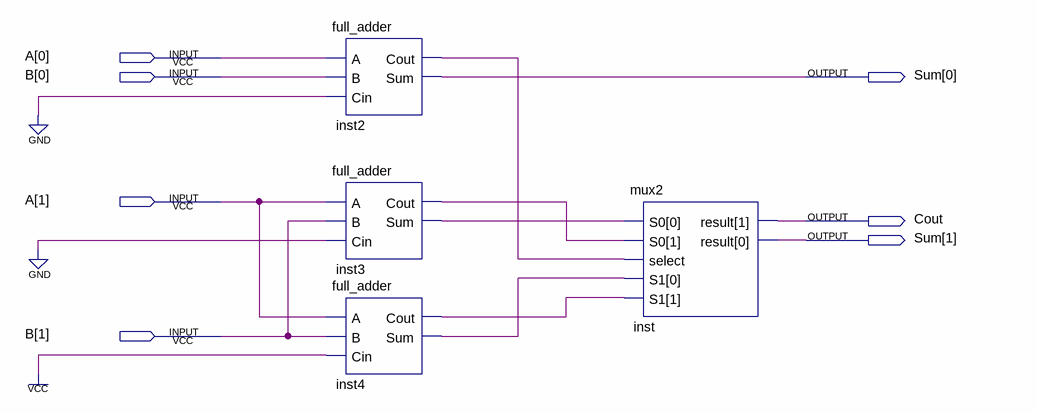
[diagram p0: schematic sheet]
// Quartus schematic csa2.bdf as structural Verilog: 4 symbols, 7 pins
module csa2 (
  input  [1:0] A,
  input  [1:0] B,
  output [1:0] Sum,
  output Cout
);

  wire inst2_cout, inst3_cout, inst3_sum, inst4_cout, inst4_sum;

  full_adder inst2 (.A(A[0]), .B(B[0]), .Cin(1'b0), .Cout(inst2_cout), .Sum(Sum[0]));
  full_adder inst3 (.A(A[1]), .B(B[1]), .Cin(1'b0), .Cout(inst3_cout), .Sum(inst3_sum));
  full_adder inst4 (.A(A[1]), .B(B[1]), .Cin(1'b1), .Cout(inst4_cout), .Sum(inst4_sum));
  mux2 inst (.S0({inst3_cout, inst3_sum}), .select(inst2_cout), .S1({inst4_cout, inst4_sum}), .result({Cout, Sum[1]}));
endmodule
